# Altium project Right Board.PrjPCB
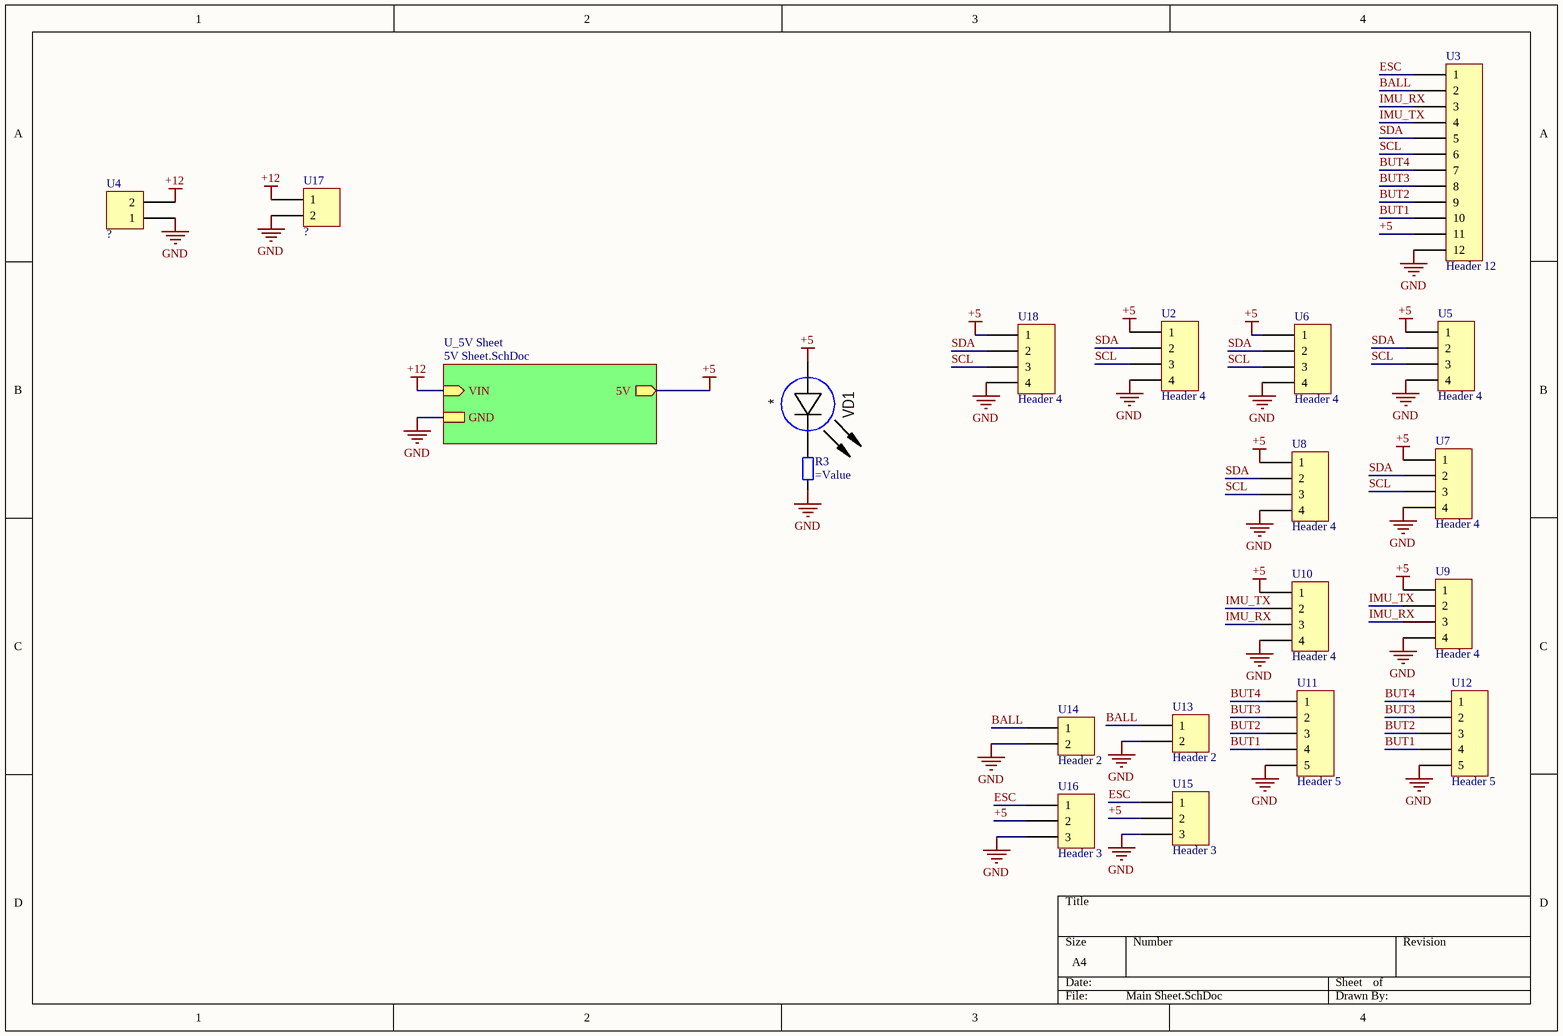
[diagram p0: Main Sheet.SchDoc]
2 sheets, 26 parts. Net scope: hierarchical (ports join the sheet entries above them; power ports are global).
Board file: Right Board.PcbDoc
Sheets:
  Main Sheet.SchDoc
    U_5V Sheet = 5V Sheet.SchDoc

## Sheet Main Sheet.SchDoc
size A4

### Parts
R3  (no value)  [res0402]
U2  Header 4  [4x2.54]
U3  Header 12  [12x1.27]
U4  ?  [XT30]
U5  Header 4  [4x2.54]
U6  Header 4  [4x1.27]
U7  Header 4  [4x2.54]
U8  Header 4  [4x1.27]
U9  Header 4  [4x2.54]
U10  Header 4  [4x1.27]
U11  Header 5  [5x1.27]
U12  Header 5  [5x2.54]
U13  Header 2  [2x2.54]
U14  Header 2  [2x1.27]
U15  Header 3  [3x2.54]
U16  Header 3  [3x1.27]
U17  ?  [XT30]
U18  Header 4  [4x1.27]
VD1  *  [CH0603LB]

### Sub-sheets
U_5V Sheet = 5V Sheet.SchDoc: VIN (in), 5V (out), GND

### Nets
+5: U2.1 U3.11 U5.1 U6.1 U7.1 U8.1 U9.1 U10.1 U15.2 U16.2 U18.1 VD1.1(A) ; sheet U_5V Sheet/5V
+12: U4.2 U17.1 ; sheet U_5V Sheet/VIN
GND: R3.1 U2.4 U3.12 U4.1 U5.4 U6.4 U7.4 U8.4 U9.4 U10.4 U11.5 U12.5 U13.2 U14.2 U15.3 U16.3 U17.2 U18.4 ; sheet U_5V Sheet/GND
BALL: U3.2 U13.1 U14.1
BUT1: U3.10 U11.4 U12.4
BUT2: U3.9 U11.3 U12.3
BUT3: U3.8 U11.2 U12.2
BUT4: U3.7 U11.1 U12.1
ESC: U3.1 U15.1 U16.1
IMU_RX: U3.3 U9.3 U10.3
IMU_TX: U3.4 U9.2 U10.2
SCL: U2.3 U3.6 U5.3 U6.3 U7.3 U8.3 U18.3
SDA: U2.2 U3.5 U5.2 U6.2 U7.2 U8.2 U18.2
NetR3_2: R3.2 VD1.2(C)

### Library data of the parts
R3 = Resistor SMD
U4 U17 = Power connectors
VD1 = LED: Manufacturer: *; Model: *; HelpURL: *; ComponentKind: *; Value: *

## Sheet 5V Sheet.SchDoc
size A4
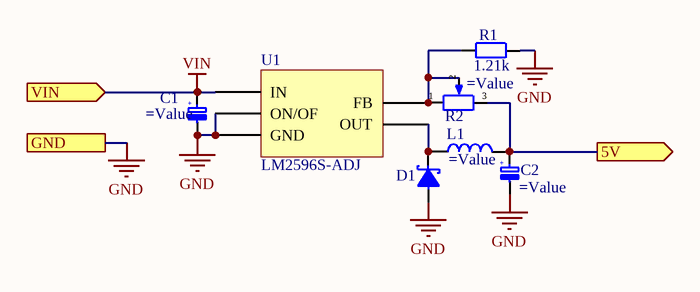
[diagram p1: 5V Sheet.SchDoc]

### Parts
C1  (no value)  [D8C3.2H12]
C2  (no value)  [D8C3.2H12]
D1  MBRS340T3G  [DO214AB(SMC)]  (value not drawn)
L1  (no value)  [SRR1280]
R1  1.21k  [res0603]
R2  (no value)  [3224W]
U1  LM2596S-ADJ  [TO263-5L]

### Ports
5V (out), GND, VIN (in)

### Nets
+5: C2.1(PLUS) L1.2 R2.3 ; port 5V
GND: C1.1(MINUS) C2.2(MINUS) D1.1 R1.2 U1.3(GND) U1.5(ON/OF) ; port GND
VIN: C1.2(PLUS) U1.1(IN) ; port VIN  [project net +12]
NetD1_2: D1.2 L1.1 U1.2(OUT)
NetR1_1: R1.1 R2.1 R2.2 U1.4(FB)

### Notes on the sheet
- (in symbol Cap Electrolytic) +
- (in symbol Cap Tantal) +

### Library data of the parts
C1 = Cap Tantal: pin to pad: 1>2 2>1
C2 = Cap Electrolytic
L1 = Inductor
R1 = Resistor SMD
R2 = Potentiometer

## Nets that join several sheets
+5: Main Sheet (12 pins), 5V Sheet (C2.1 L1.2 R2.3)
+12: Main Sheet (U4.2 U17.1), 5V Sheet (C1.2 U1.1)
GND: Main Sheet (18 pins), 5V Sheet (6 pins)